# EAGLE design BPMLabRXDriver (EAGLE 7.5.0)
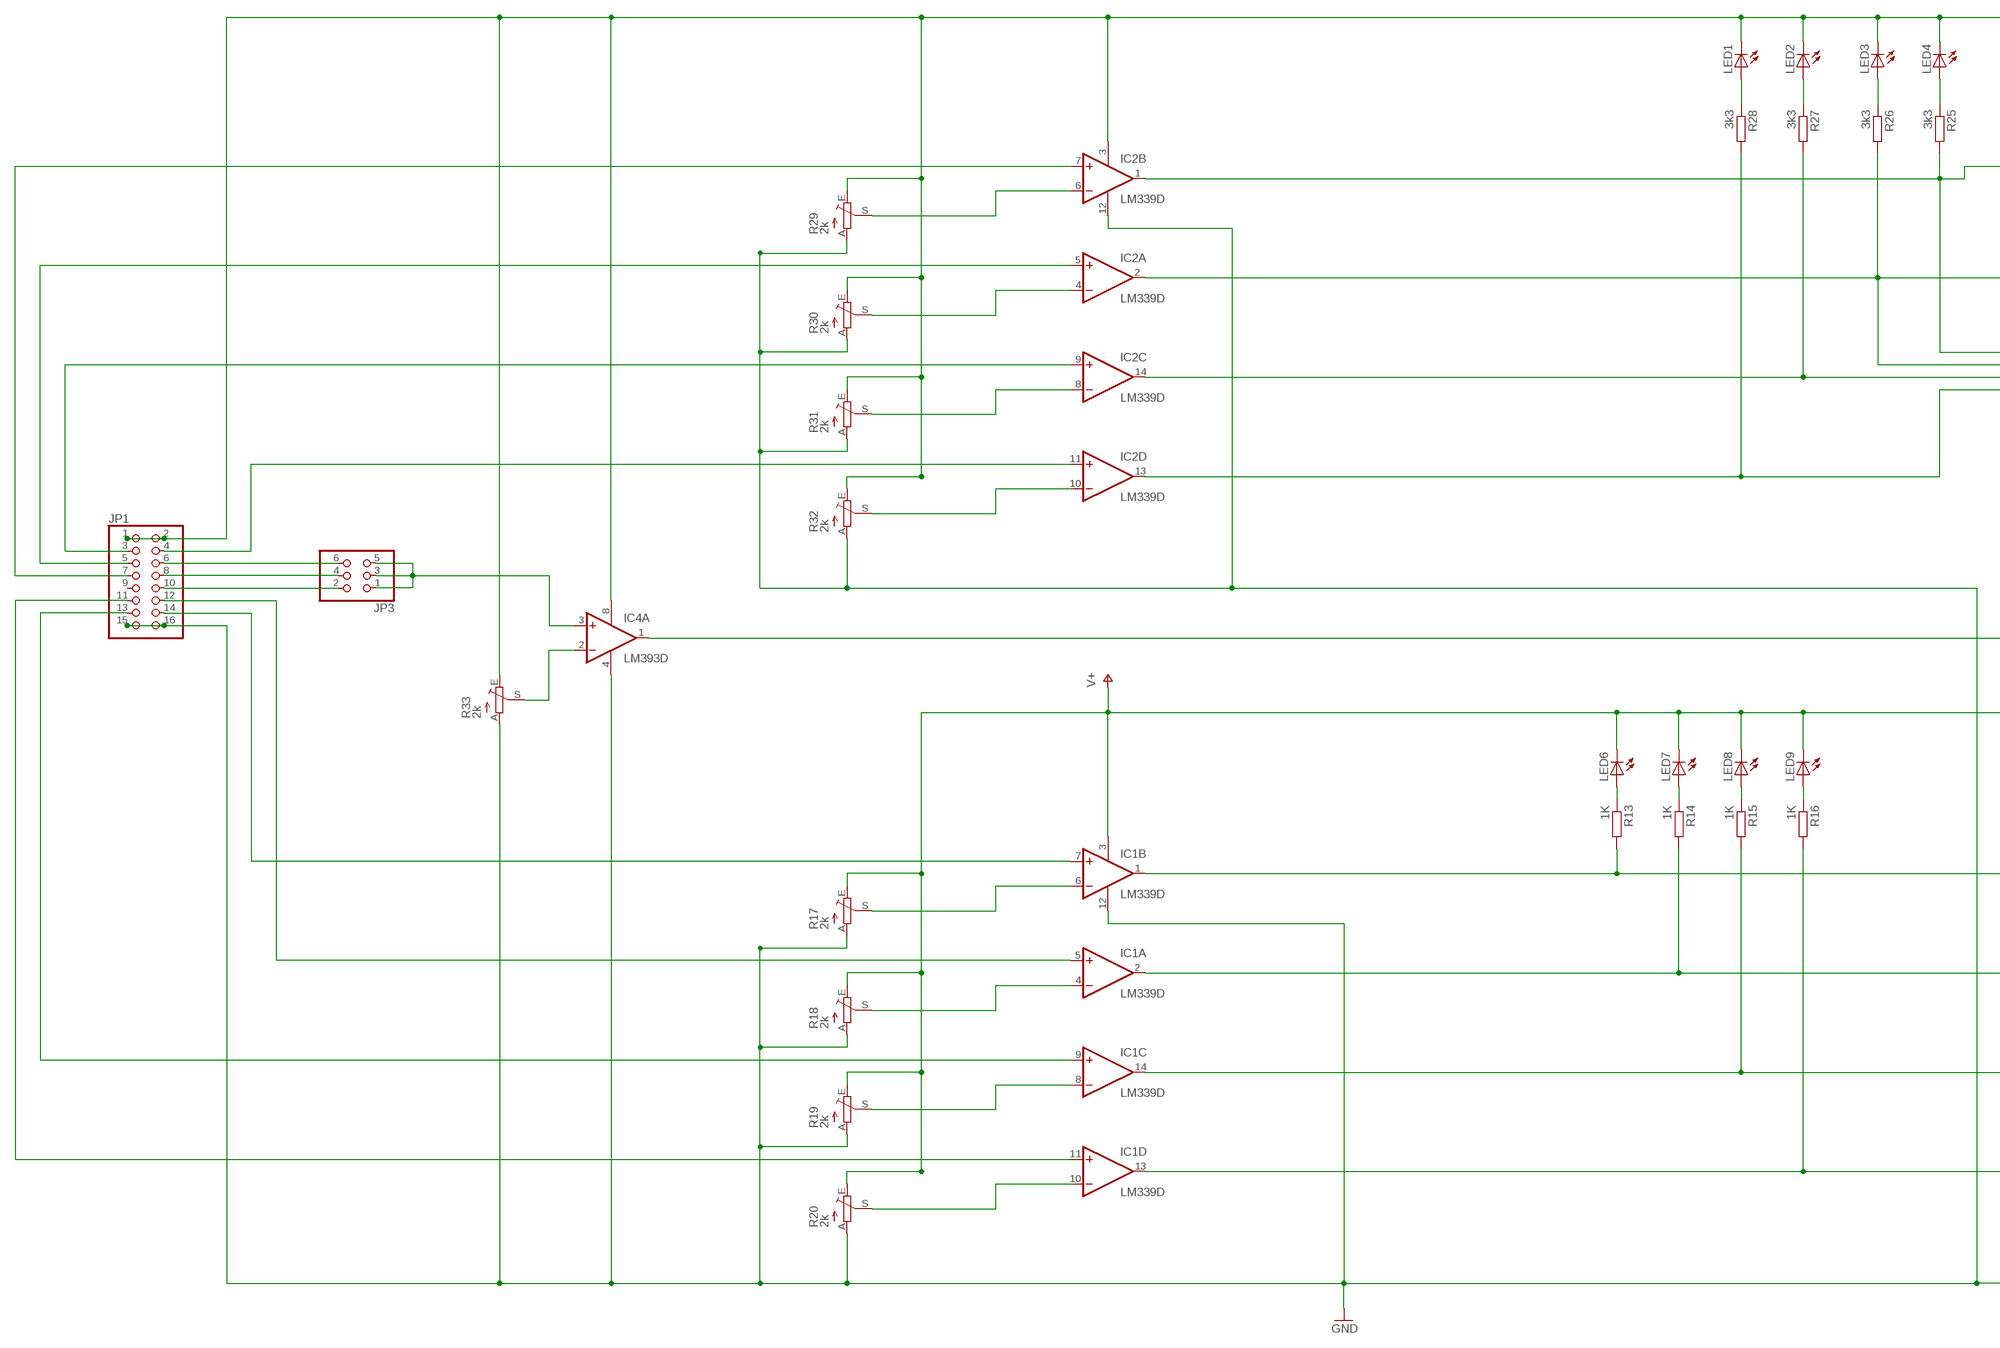
[diagram p0: schematic, sheet 1, part 1 of 2]
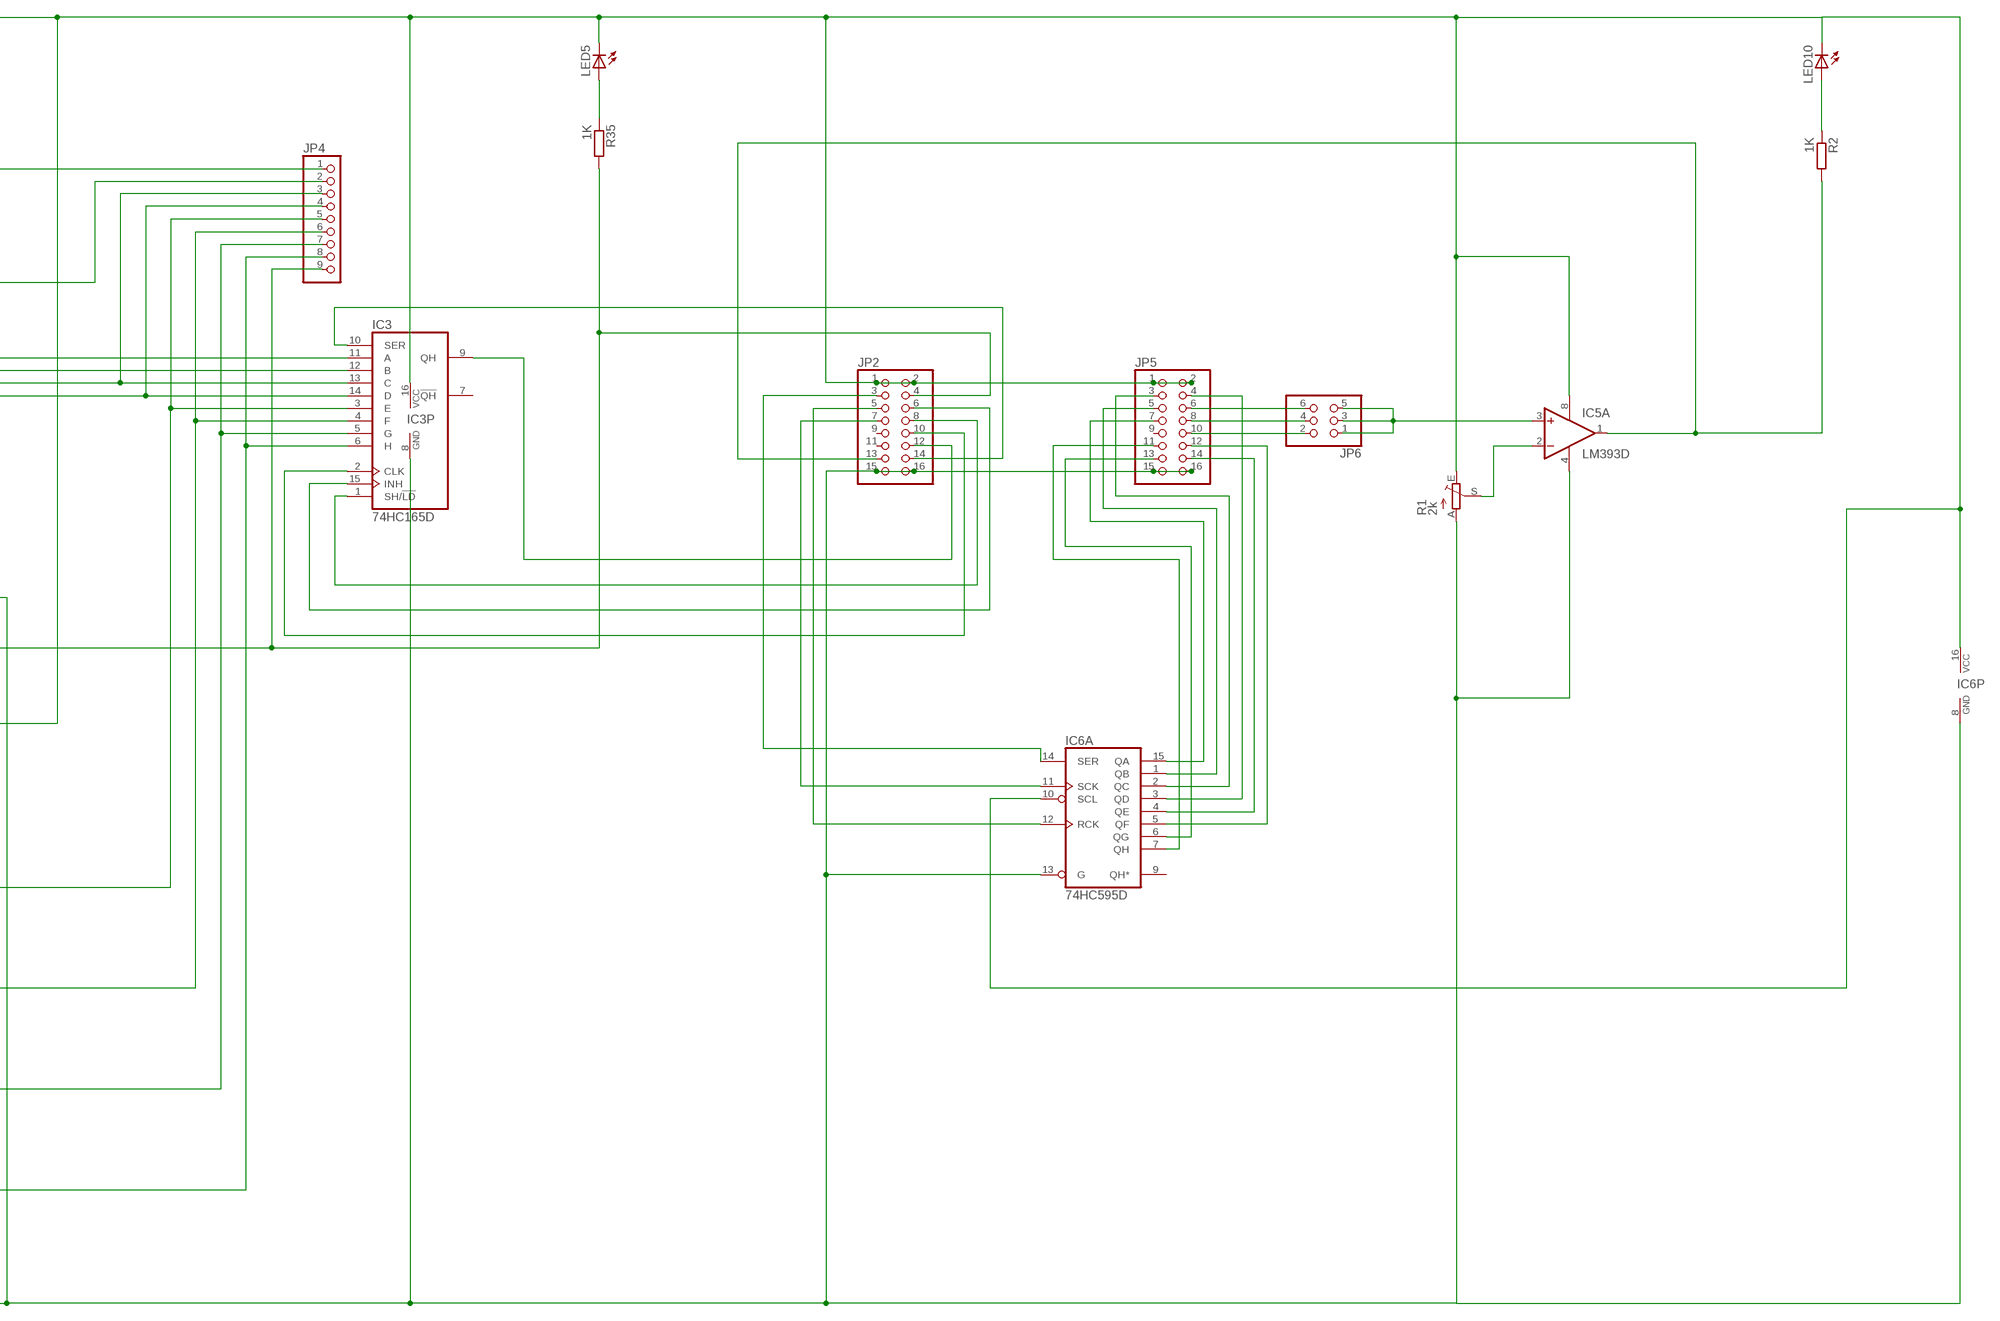
[diagram p1: schematic, sheet 1, part 2 of 2]

## Parts
IC1  LM339D  [SO14]
IC2  LM339D  [SO14]
IC3  74HC165D  [SO16]
IC4  LM393D  [SO08]
IC5  LM393D  [SO08]
IC6  74HC595D  [SO16]
JP1  PINHD-2X8  [2X08]
JP2  PINHD-2X8  [2X08]
JP3  PINHD-2X3  [2X03]
JP4  PINHD-1X9  [1X09]
JP5  PINHD-2X8  [2X08]
JP6  PINHD-2X3  [2X03]
LED1  LED5MM  [LED5MM]
LED2  LED5MM  [LED5MM]
LED3  LED5MM  [LED5MM]
LED4  LED5MM  [LED5MM]
LED5  LED5MM  [LED5MM]
LED6  LED5MM  [LED5MM]
LED7  LED5MM  [LED5MM]
LED8  LED5MM  [LED5MM]
LED9  LED5MM  [LED5MM]
LED10  LED5MM  [LED5MM]
R1  2k  TRIM_EU-RS3  [RS3]
R2  1K  R-EU_M0805  [M0805]
R13  1K  R-EU_M0805  [M0805]
R14  1K  R-EU_M0805  [M0805]
R15  1K  R-EU_M0805  [M0805]
R16  1K  R-EU_M0805  [M0805]
R17  2k  TRIM_EU-RS3  [RS3]
R18  2k  TRIM_EU-RS3  [RS3]
R19  2k  TRIM_EU-RS3  [RS3]
R20  2k  TRIM_EU-RS3  [RS3]
R25  3k3  R-EU_M0805  [M0805]
R26  3k3  R-EU_M0805  [M0805]
R27  3k3  R-EU_M0805  [M0805]
R28  3k3  R-EU_M0805  [M0805]
R29  2k  TRIM_EU-RS3  [RS3]
R30  2k  TRIM_EU-RS3  [RS3]
R31  2k  TRIM_EU-RS3  [RS3]
R32  2k  TRIM_EU-RS3  [RS3]
R33  2k  TRIM_EU-RS3  [RS3]
R35  1K  R-EU_M0805  [M0805]

## Nets
GND: IC1.12(P:GND) IC2.12(P:GND) IC3.8(GND) IC4.4(P:V-) IC5.4(P:V-) IC6.8(P:GND) IC6.13(A:G) JP1.15 JP1.16 JP2.15 JP2.16 JP5.15 JP5.16 R1.A R17.A R18.A R19.A R20.A R29.A R30.A R31.A R32.A R33.A
N$1: IC1.7(B:+IN) JP1.14
N$2: IC3.10(SER) JP2.14
N$3: IC1.9(C:+IN) JP1.13
N$4: IC2.7(B:+IN) JP1.7
N$5: IC1.13(D:OUT) IC3.6(H) JP4.8 R16.2
N$6: IC1.14(C:OUT) IC3.5(G) JP4.7 R15.2
N$7: IC1.2(A:OUT) IC3.4(F) JP4.6 R14.2
N$8: IC1.1(B:OUT) IC3.3(E) JP4.5 R13.2
N$9: LED6.A R13.1
N$10: LED7.A R14.1
N$11: LED8.A R15.1
N$12: LED9.A R16.1
N$13: IC1.6(B:-IN) R17.S
N$14: JP5.6 JP6.6
N$15: JP5.8 JP6.4
N$16: JP5.10 JP6.2
N$17: IC5.3(A:+IN) JP6.1 JP6.3 JP6.5
N$18: IC2.5(A:+IN) JP1.5
N$19: IC2.9(C:+IN) JP1.3
N$20: IC1.4(A:-IN) R18.S
N$21: IC1.8(C:-IN) R19.S
N$22: IC1.10(D:-IN) R20.S
N$23: IC2.13(D:OUT) IC3.14(D) JP4.4 R28.2
N$24: IC2.14(C:OUT) IC3.13(C) JP4.3 R27.2
N$25: IC1.11(D:+IN) JP1.11
N$26: IC2.2(A:OUT) IC3.12(B) JP4.2 R26.2
N$27: IC2.1(B:OUT) IC3.11(A) JP4.1 R25.2
N$28: LED1.A R28.1
N$29: LED2.A R27.1
N$30: LED3.A R26.1
N$31: LED4.A R25.1
N$32: LED5.A R35.1
N$33: IC6.15(A:QA) JP5.7
N$34: IC6.14(A:SER) JP2.3
N$35: IC5.2(A:-IN) R1.S
N$36: IC2.6(B:-IN) R29.S
N$37: IC2.4(A:-IN) R30.S
N$38: IC2.8(C:-IN) R31.S
N$39: IC2.10(D:-IN) R32.S
N$40: IC2.11(D:+IN) JP1.4
N$41: IC6.11(A:SCK) JP2.7
N$42: IC4.1(A:OUT) JP2.4 JP4.9 R35.2
N$43: IC3.15(INH) JP2.6
N$44: IC3.1(SH/!LD) JP2.8
N$45: IC3.2(CLK) JP2.10
N$46: IC3.9(QH) JP2.12
N$47: IC6.12(A:RCK) JP2.5
N$48: IC1.5(A:+IN) JP1.12
N$49: IC5.1(A:OUT) JP2.13 R2.2
N$50: JP1.6 JP3.6
N$51: JP1.8 JP3.4
N$52: JP1.10 JP3.2
N$53: IC4.3(A:+IN) JP3.1 JP3.3 JP3.5
N$54: IC4.2(A:-IN) R33.S
N$55: IC6.1(A:QB) JP5.5
N$56: LED10.A R2.1
N$57: IC6.2(A:QC) JP5.3
N$58: IC6.3(A:QD) JP5.4
N$59: IC6.4(A:QE) JP5.14
N$60: IC6.5(A:QF) JP5.12
N$61: IC6.6(A:QG) JP5.13
N$62: IC6.7(A:QH) JP5.11
VCC: IC1.3(P:V+) IC2.3(P:V+) IC3.16(VCC) IC4.8(P:V+) IC5.8(P:V+) IC6.10(A:SCL) IC6.16(P:VCC) JP1.1 JP1.2 JP2.1 JP2.2 JP5.1 JP5.2 LED1.K(C) LED2.K(C) LED3.K(C) LED4.K(C) LED5.K(C) LED6.K(C) LED7.K(C) LED8.K(C) LED9.K(C) LED10.K(C) R1.E R17.E R18.E R19.E R20.E R29.E R30.E R31.E R32.E R33.E ; supply symbol labelled V+
Unconnected: IC3.7(!QH) IC4.5(B:+IN) IC4.6(B:-IN) IC4.7(B:OUT) IC5.5(B:+IN) IC5.6(B:-IN) IC5.7(B:OUT) IC6.9(A:QH*) JP1.9 JP2.9 JP2.11 JP5.9

## Library data of the parts
IC1 IC2 = linear:LM339: Low Power Low Offset Voltage Quad Comparators with open collector; LM139/LM239/LM339/LM2901/LM3302
IC3 = 74xx-eu:74*165: 8-bit parallel load SHIFT REGISTER
IC4 IC5 = linear:LM393: COMPARATOR
IC6 = 74xx-eu:74*595: 8-bit SHIFT REGISTER, output latch
JP1 JP2 JP5 = pinhead:PINHD-2X8: PIN HEADER
JP3 JP6 = pinhead:PINHD-2X3: PIN HEADER
JP4 = pinhead:PINHD-1X9: PIN HEADER
LED1-LED10 = led:LED: LED OSRAM: - CHIPLED LG R971, LG N971, LY N971, LG Q971, LY Q971, LO R971, LY R971 LH N974, LH R974 LS Q976, LO Q976, LY Q976 LO Q996 - Hyper CHIPLED LW Q18S LB Q993, LB Q99A, LB R99A - SideLED LS A670, LO A670, LY A670, LG A670, LP A670 LB A673, LV A673, LT A673, LW A673 LH A674 LY A675 LS A676, LA A676, LO A676, LY A676, LW A676 LS A679, LY A679, LG A679 - Hyper Micro SIDELED® LS Y876, LA Y876, LO Y876, LY Y876 LT Y87S - SmartLED LW L88C, LW L88S LB L89C, LB L89S, LG L890 LS L89K, LO L89K, LY L89K LS L896, LA L896, LO L896, LY L896 - TOPLED LS T670, LO T670, LY T670, LG T670, LP T670 LSG T670, LSP T670, LSY T670, LOP T670, LYG T670 LG T671, LOG T671, LSG T671 LB T673, LV T673, LT T673, LW T673 LH T674 LS T676, LA T676, LO T676, LY T676, LB T676, LH T676, LSB T676, LW T676 LB T67C, LV T67C, LT T67C, LS T67K, LO T67K, LY T67K, LW E67C LS E67B, LA E67B, LO E67B, LY E67B, LB E67C, LV E67C, LT E67C LW T67C LS T679, LY T679, LG T679 LS T770, LO T770, LY T770, LG T770, LP T770 LB T773, LV T773, LT T773, LW T773 LH T774 LS E675, LA E675, LY E675, LS T675 LS T776, LA T776, LO T776, LY T776, LB T776 LHGB T686 LT T68C, LB T68C - Hyper Mini TOPLED® LB M676 - Mini TOPLED Santana® LG M470 LS M47K, LO M47K, LY M47K Source: http://www.osram.convergy.de LUXEON: - LUMILED® LXK2-PW12-R00, LXK2-PW12-S00, LXK2-PW14-U00, LXK2-PW14-V00 LXK2-PM12-R00, LXK2-PM12-S00, LXK2-PM14-U00 LXK2-PE12-Q00, LXK2-PE12-R00, LXK2-PE12-S00, LXK2-PE14-T00, LXK2-PE14-U00 LXK2-PB12-K00, LXK2-PB12-L00, LXK2-PB12-M00, LXK2-PB14-N00, LXK2-PB14-P00, LXK2-PB14-Q00 LXK2-PR12-L00, LXK2-PR12-M00, LXK2-PR14-Q00, LXK2-PR14-R00 LXK2-PD12-Q00, LXK2-PD12-R00, LXK2-PD12-S00 LXK2-PH12-R00, LXK2-PH12-S00 LXK2-PL12-P00, LXK2-PL12-Q00, LXK2-PL12-R00 Source: www.luxeon.com KINGBRIGHT: KA-3528ASYC Source: www.kingbright.com
R1 R17-R20 R29-R33 = pot:TRIM_EU-: POTENTIOMETER
R2 R13-R16 R25-R28 R35 = resistor:R-EU_: RESISTOR, European symbol

## Board
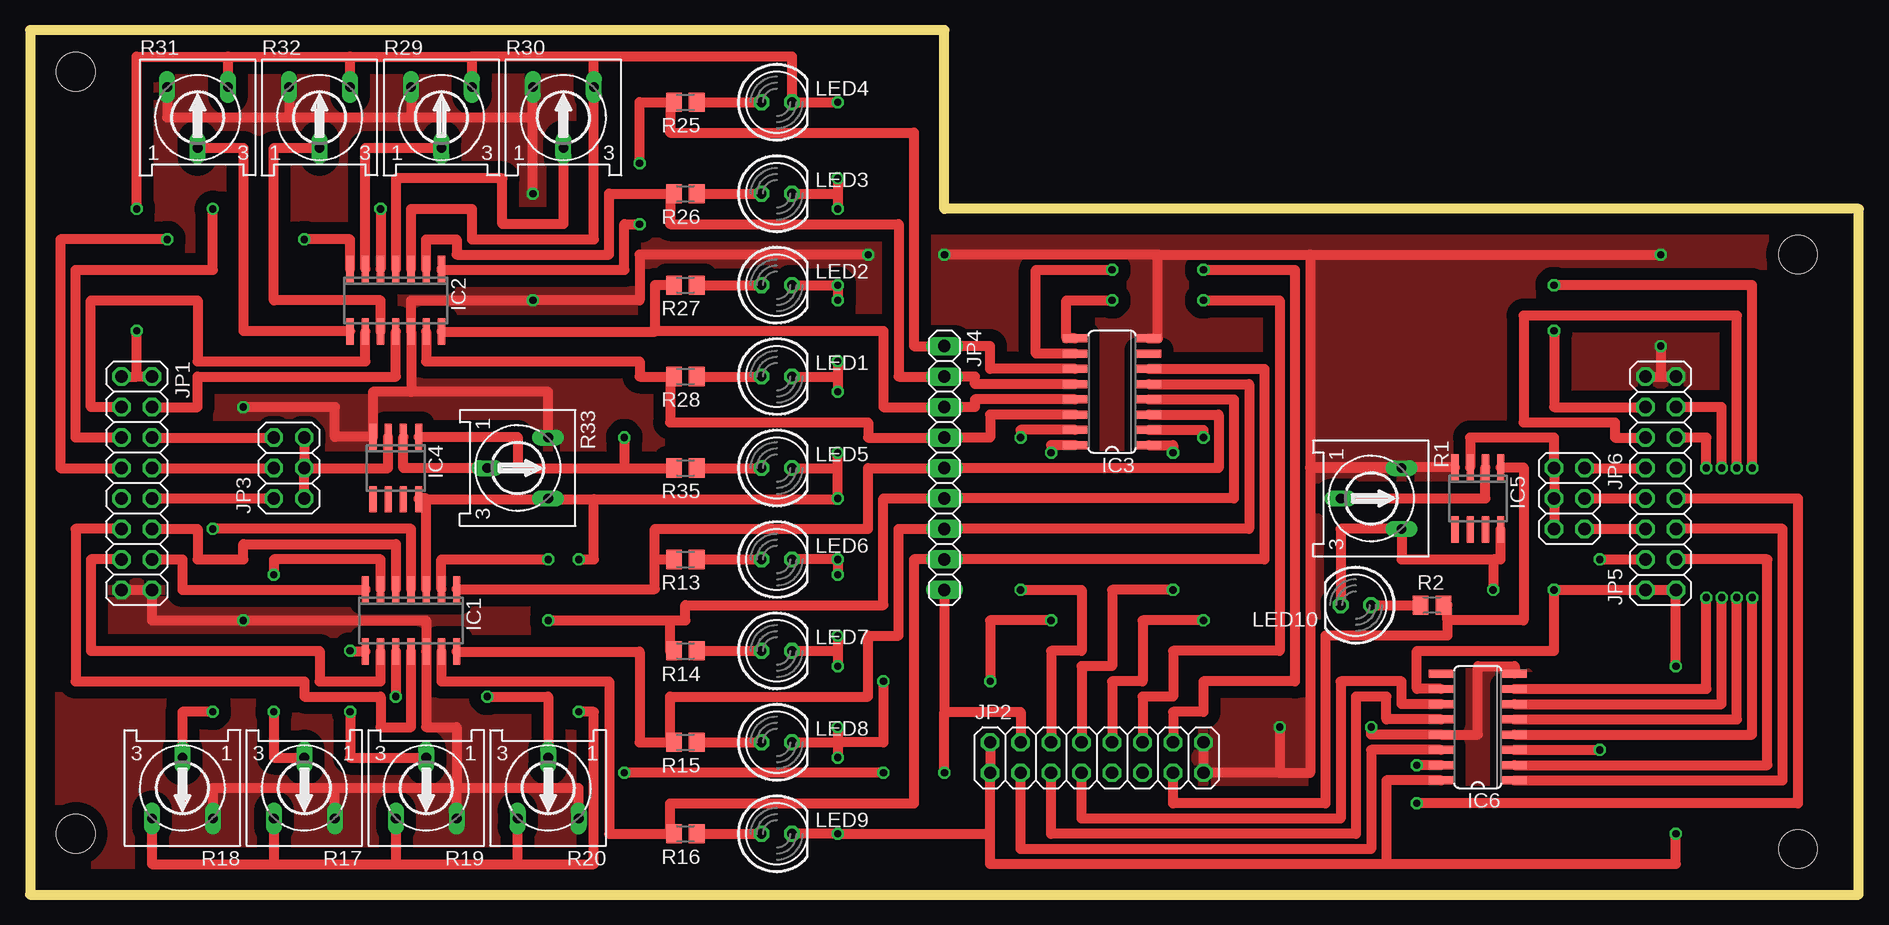
[diagram p2: board, top side]
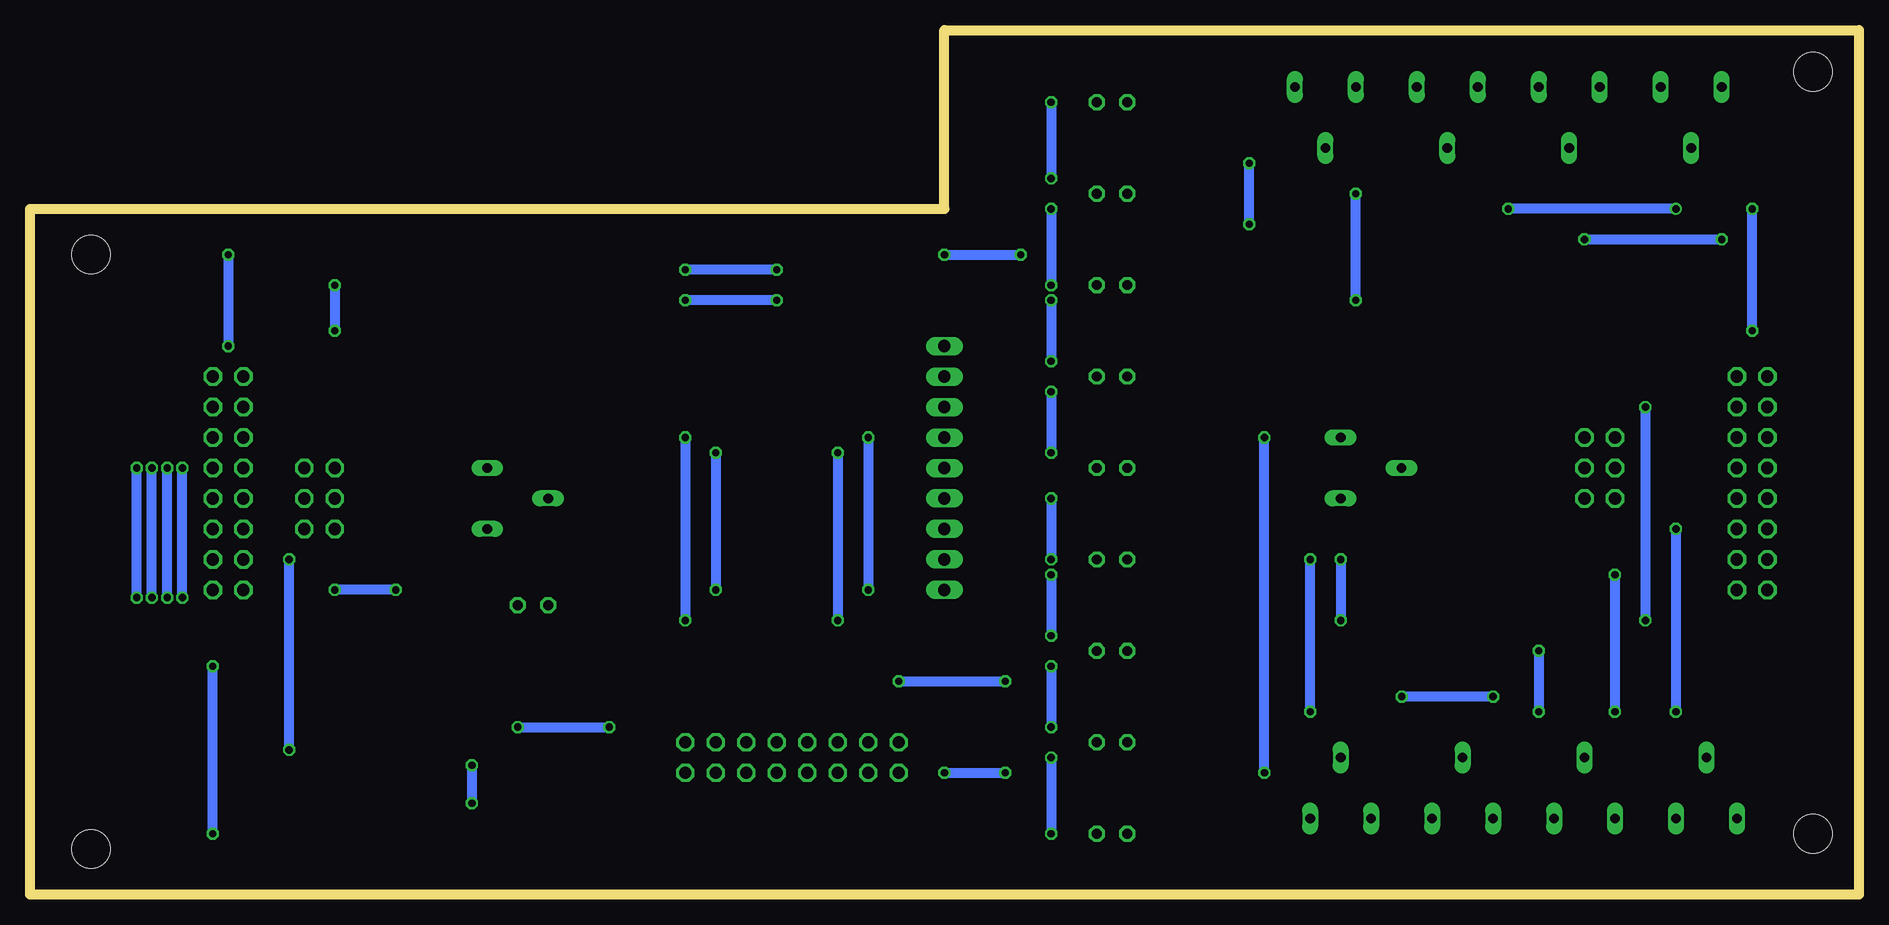
[diagram p3: board, bottom side, seen from below]

Size 152.4 x 72.06 mm. Coordinates in mm from the lower left corner, seen from the top.
Outline: 0,0 152.38,0 152.4,57.15 76.2,57.15 76.2,72.06 0,72.06 0,0
Copper layers (1*16): Top 0.035mm / dielectric 1.5mm / Bottom 0.035mm
Design rules "default *": minimum track width 10mil, minimum drill 20mil, track to track 8mil, track to pad 8mil, pad to pad 8mil, via to via 8mil, smd to smd 8mil, copper to edge 40mil, drill to drill 8mil, minimum pad ring 10mil, minimum via ring 8mil, stop-mask expansion 4mil, vias tented up to drill 0mil, thermal gap 0mil
Holes 3.2 mm at 3.81,68.58 3.81,5.08 147.32,3.81 147.32,53.34

### Footprints (pad centres in the part's own frame; a part is rotated, then mirrored left to right if it is on the bottom)
SO14 = smd 0.6 x 2.2: 1 -3.81,-2.6; 2 -2.54,-2.6; 3 -1.27,-2.6; 4 0,-2.6; 5 1.27,-2.6; 6 2.54,-2.6; 7 3.81,-2.6; 8 3.81,2.6; 9 2.54,2.6; 10 1.27,2.6; 11 0,2.6; 12 -1.27,2.6; 13 -2.54,2.6; 14 -3.81,2.6
SO16 = smd 0.66 x 2.032: 1 -4.445,-3.073; 2 -3.175,-3.073; 3 -1.905,-3.073; 4 -0.635,-3.073; 5 0.635,-3.073; 6 1.905,-3.073; 7 3.175,-3.073; 8 4.445,-3.073; 9 4.445,3.073; 10 3.175,3.073; 11 1.905,3.073; 12 0.635,3.073; 13 -0.635,3.073; 14 -1.905,3.073; 15 -3.175,3.073; 16 -4.445,3.073
SO08 = smd 0.6 x 2.2: 1 -1.905,-2.6; 2 -0.635,-2.6; 3 0.635,-2.6; 4 1.905,-2.6; 5 1.905,2.6; 6 0.635,2.6; 7 -0.635,2.6; 8 -1.905,2.6
2X08 = drill 1.016 octagon: 1 -8.89,-1.27; 2 -8.89,1.27; 3 -6.35,-1.27; 4 -6.35,1.27; 5 -3.81,-1.27; 6 -3.81,1.27; 7 -1.27,-1.27; 8 -1.27,1.27; 9 1.27,-1.27; 10 1.27,1.27; 11 3.81,-1.27; 12 3.81,1.27; 13 6.35,-1.27; 14 6.35,1.27; 15 8.89,-1.27; 16 8.89,1.27
2X03 = drill 1.016 octagon: 1 -2.54,-1.27; 2 -2.54,1.27; 3 0,-1.27; 4 0,1.27; 5 2.54,-1.27; 6 2.54,1.27
1X09 = drill 1.016 long: 1 -10.16,0; 2 -7.62,0; 3 -5.08,0; 4 -2.54,0; 5 0,0; 6 2.54,0; 7 5.08,0; 8 7.62,0; 9 10.16,0
LED5MM = drill 0.813 octagon: A -1.27,0; K 1.27,0
RS3 = drill 0.813 long: A -2.54,2.54; E 2.54,2.54; S 0,-2.54
M0805 = smd 1.3 x 1.6: 1 -0.95,0; 2 0.95,0

### Placement (x,y rotation side)
IC1  31.75,22.86 180 top
IC2  30.48,49.53 180 top
IC3  90.17,41.91 90 top
IC4  30.48,35.56 180 top
IC5  120.65,33.02 180 top
IC6  120.65,13.97 90 top
JP1  8.89,34.29 270 top
JP2  88.9,11.43 0 top
JP3  21.59,35.56 90 top
JP4  76.2,35.56 270 top
JP5  135.89,34.29 90 top
JP6  128.27,33.02 270 top
LED1  62.23,43.18 0 top
LED2  62.23,50.8 0 top
LED3  62.23,58.42 0 top
LED4  62.23,66.04 0 top
LED5  62.23,35.56 0 top
LED6  62.23,27.94 0 top
LED7  62.23,20.32 0 top
LED8  62.23,12.7 0 top
LED9  62.23,5.08 0 top
LED10  110.49,24.13 180 top
R1  111.76,33.02 270 top
R2  116.84,24.13 0 top
R13  54.61,27.94 180 top
R14  54.61,20.32 180 top
R15  54.61,12.7 180 top
R16  54.61,5.08 180 top
R17  22.86,8.89 180 top
R18  12.7,8.89 180 top
R19  33.02,8.89 180 top
R20  43.18,8.89 180 top
R25  54.61,66.04 180 top
R26  54.61,58.42 180 top
R27  54.61,50.8 180 top
R28  54.61,43.18 180 top
R29  34.29,64.77 0 top
R30  44.45,64.77 0 top
R31  13.97,64.77 0 top
R32  24.13,64.77 0 top
R33  40.64,35.56 270 top
R35  54.61,35.56 180 top

### Tracks (layer width: path | path; a pad name or v marks a point on that pad's centre or on a via)
GND  (via drill 0.6)
  Top 0.813: R31.A 11.43,64.77 21.59,64.77 | R32.A 21.59,64.77 | 21.59,64.77 31.75,64.77 | R29.A 31.75,64.77 | 31.75,64.77 41.91,64.77 | 41.91,64.77 R30.A | 31.75,41.91 IC2.12 31.75,49.53 v41.91,49.53 50.8,49.53 50.8,53.34 v69.85,53.34 | 31.75,41.91 28.57,41.91 IC4.4 25.4,38.16 25.4,40.64 v17.78,40.64 | R33.A 43.18,41.91 31.75,41.91 | JP1.15 JP1.16 10.16,22.86 v17.78,22.86 33.02,22.86 IC1.12 33.02,13.97 35.56,13.97 35.56,8.89 | R20.A 45.72,8.89 35.56,8.89 | R19.A 35.56,8.89 | 35.56,8.89 25.4,8.89 | R17.A 25.4,8.89 | 25.4,8.89 15.24,8.89 R18.A | v41.91,58.42 41.91,64.77 | JP2.16 JP2.15 104.14,10.16 | 93.98,53.34 106.68,53.34 | 106.68,53.34 106.68,35.62 | 106.68,35.62 106.68,35.56 | 106.68,35.56 106.68,10.16 104.14,10.16 | 93.98,53.34 v76.2,53.34 | IC3.8 93.98,46.35 93.98,53.34 | 106.68,53.34 v135.89,53.34 | JP5.16 135.89,43.18 | v135.89,45.72 135.89,43.18 | 135.89,43.18 JP5.15 | IC5.4 106.68,35.62 | IC6.8 123.72,19.05 120.65,19.05 120.65,13.34 IC6.13 111.76,13.34 v111.76,13.97 | v104.14,13.97 104.14,10.16 | R1.A 106.68,35.56
  Bottom 0.813: v17.78,40.64 v17.78,22.86 | v41.91,49.53 v41.91,58.42 | v76.2,53.34 v69.85,53.34 | v135.89,53.34 v135.89,45.72 | v111.76,13.97 v104.14,13.97
  pour Top (isolate 1.016): 2.54,69.85 73.66,69.85 73.66,54.61 149.86,54.61 149.86,2.54 2.54,2.54
N$1
  Top 0.813: JP1.14 12.7,27.94 12.7,25.4 27.94,25.4 IC1.7
N$2  (via drill 0.6)
  Top 0.813: IC3.10 83.82,45.09 83.82,52.07 v90.17,52.07 | v97.79,52.07 105.41,52.07 105.41,17.78 97.79,17.78 97.79,15.24 95.25,15.24 JP2.14
  Bottom 0.813: v90.17,52.07 v97.79,52.07
N$3
  Top 0.813: JP1.13 5.08,27.94 5.08,20.32 24.13,20.32 24.13,17.78 29.21,17.78 IC1.9
N$4  (via drill 0.6)
  Top 0.813: IC2.7 26.67,54.61 v22.86,54.61 | v11.43,54.61 2.54,54.61 2.54,35.56 JP1.7
  Bottom 0.813: v22.86,54.61 v11.43,54.61
N$5
  Top 0.813: IC1.13 34.29,17.78 48.26,17.78 48.26,5.08 R16.2 53.34,5.08 53.34,7.62 73.66,7.62 73.66,27.94 JP4.8 102.87,27.94 102.87,43.81 IC3.6
N$6
  Top 0.813: IC1.14 50.8,20.26 50.8,12.7 R15.2 53.34,12.7 53.34,16.51 69.85,16.51 69.85,21.59 72.39,21.59 72.39,30.48 JP4.7 101.6,30.48 101.6,42.55 IC3.5
N$7  (via drill 0.6)
  Top 0.813: IC1.2 34.29,27.94 v43.18,27.94 | v43.18,22.86 53.34,22.86 | R14.2 53.34,20.32 53.34,22.86 | 53.34,22.86 54.61,22.86 54.61,24.13 71.12,24.13 71.12,33.02 JP4.6 100.33,33.02 100.33,41.27 IC3.4
  Bottom 0.813: v43.18,27.94 v43.18,22.86
N$8
  Top 0.813: IC1.1 52.07,25.46 52.07,27.94 | 52.07,27.94 R13.2 | 52.07,27.94 52.07,30.48 69.85,30.48 69.85,35.56 JP4.5 99.06,35.56 99.06,40.01 IC3.3
N$9
  Top 0.813: R13.1 LED6.A
N$10
  Top 0.813: R14.1 LED7.A
N$11
  Top 0.813: R15.1 LED8.A
N$12
  Top 0.813: R16.1 LED9.A
N$13  (via drill 0.6)
  Top 0.813: IC1.6 29.21,27.94 20.32,27.94 v20.32,26.67 | v20.32,15.24 20.32,11.43 R17.S
  Bottom 0.813: v20.32,26.67 v20.32,15.24
N$14
  Top 0.813: JP6.6 JP5.6
N$15
  Top 0.813: JP6.4 JP5.8
N$16
  Top 0.813: JP6.2 JP5.10
N$17
  Top 0.813: IC5.3 120.02,38.1 127,38.1 JP6.1 JP6.3 JP6.5
N$18  (via drill 0.6)
  Top 0.813: JP1.5 3.81,38.1 3.81,52.07 15.24,52.07 v15.24,57.15 | v29.21,57.15 IC2.5
  Bottom 0.813: v15.24,57.15 v29.21,57.15
N$19
  Top 0.813: JP1.3 5.08,40.64 5.08,49.53 13.97,49.53 13.97,44.45 27.94,44.45 IC2.9
N$20  (via drill 0.6)
  Top 0.813: IC1.4 31.75,30.48 v15.24,30.48 | v15.24,15.24 12.7,15.24 R18.S
  Bottom 0.813: v15.24,30.48 v15.24,15.24
N$21  (via drill 0.6)
  Top 0.813: IC1.8 26.67,20.26 v26.67,20.32 | v26.67,15.24 26.67,11.43 R19.S
  Bottom 0.813: v26.67,20.32 v26.67,15.24
N$22  (via drill 0.6)
  Top 0.813: IC1.10 v30.48,16.51 | v38.1,16.51 43.18,16.51 R20.S
  Bottom 0.813: v30.48,16.51 v38.1,16.51
N$23
  Top 0.813: IC2.13 33.02,44.45 50.8,44.45 50.8,43.18 R28.2 53.34,43.18 53.34,39.37 69.85,39.37 69.85,38.1 JP4.4 80.01,38.1 80.01,40.01 IC3.14
N$24
  Top 0.813: IC2.14 52.07,46.93 52.07,46.99 | R27.2 52.07,50.8 52.07,46.99 | 52.07,46.99 71.12,46.99 71.12,40.64 JP4.3 78.74,40.64 78.74,41.27 IC3.13
N$25
  Top 0.813: JP1.11 3.81,30.48 3.81,17.78 22.86,17.78 22.86,16.51 29.21,16.51 29.21,13.97 31.75,13.97 IC1.11
N$26
  Top 0.813: IC2.2 33.02,54.61 35.56,54.61 35.56,53.34 48.26,53.34 48.26,58.42 53.34,58.42 | R26.2 53.34,58.42 | 53.34,58.42 53.34,55.88 72.39,55.88 72.39,43.18 JP4.2 78.74,43.18 78.74,42.55 IC3.12
N$27  (via drill 0.6)
  Top 0.813: IC2.1 34.29,52.07 49.53,52.07 49.53,55.88 v50.8,55.88 | v50.8,60.96 50.8,66.04 R25.2 53.34,66.04 53.34,63.5 73.66,63.5 73.66,45.72 JP4.1 80.01,45.72 80.01,43.81 IC3.11
  Bottom 0.813: v50.8,55.88 v50.8,60.96
N$28
  Top 0.813: R28.1 LED1.A
N$29
  Top 0.813: R27.1 LED2.A
N$30
  Top 0.813: R26.1 LED3.A
N$31
  Top 0.813: R25.1 LED4.A
N$32
  Top 0.813: R35.1 LED5.A
N$33  (via drill 0.6)
  Top 0.813: JP5.7 147.32,33.02 147.32,7.62 v115.57,7.62 | IC6.15 v115.57,10.79
  Bottom 0.813: v115.57,10.79 v115.57,7.62
N$34
  Top 0.813: IC6.14 111.76,12.06 111.76,3.81 82.55,3.81 JP2.3
N$35
  Top 0.813: R1.S 121.28,33.02 IC5.2
N$36
  Top 0.813: IC2.6 27.94,62.23 R29.S
N$37
  Top 0.813: R30.S 44.45,55.88 39.37,55.88 39.37,59.69 30.48,59.69 IC2.4
N$38
  Top 0.813: R31.S 17.78,62.23 17.78,46.99 26.67,46.99 IC2.8
N$39
  Top 0.813: IC2.10 29.21,49.53 20.32,49.53 20.32,62.23 R32.S
N$40
  Top 0.813: JP1.4 13.97,40.64 13.97,43.18 30.48,43.18 IC2.11
N$41
  Top 0.813: IC6.11 114.3,15.88 114.3,17.78 109.22,17.78 109.22,6.35 87.63,6.35 JP2.7
N$42  (via drill 0.6)
  Top 0.813: IC4.1 40.64,38.16 40.64,35.56 49.53,35.56 | 49.53,35.56 R35.2 | v71.12,10.16 v49.53,10.16 | v49.53,38.1 49.53,35.56 | JP4.9 76.2,15.24 | v76.2,10.16 76.2,15.24 | 76.2,15.24 82.55,15.24 JP2.4
  Bottom 0.813: v76.2,10.16 v71.12,10.16 | v49.53,10.16 v49.53,38.1
N$43  (via drill 0.6)
  Top 0.813: IC3.15 82.55,38.73 v82.55,38.1 | v82.55,25.4 87.63,25.4 87.63,20.32 85.09,20.32 JP2.6
  Bottom 0.813: v82.55,38.1 v82.55,25.4
N$44  (via drill 0.6)
  Top 0.813: IC3.1 95.25,37.47 v95.25,36.83 | v95.25,25.4 90.17,25.4 90.17,19.05 87.63,19.05 JP2.8
  Bottom 0.813: v95.25,36.83 v95.25,25.4
N$45  (via drill 0.6)
  Top 0.813: IC3.2 97.79,38.73 v97.79,38.1 | v97.79,22.86 92.71,22.86 92.71,17.78 90.17,17.78 JP2.10
  Bottom 0.813: v97.79,38.1 v97.79,22.86
N$46  (via drill 0.6)
  Top 0.813: IC3.9 86.36,46.35 86.36,49.53 v90.17,49.53 | v97.79,49.53 104.14,49.53 104.14,20.32 95.25,20.32 95.25,16.51 92.71,16.51 JP2.12
  Bottom 0.813: v90.17,49.53 v97.79,49.53
N$47
  Top 0.813: IC6.12 113.03,14.61 113.03,16.51 110.49,16.51 110.49,5.08 85.09,5.08 JP2.5
N$48
  Top 0.813: JP1.12 13.97,30.48 13.97,27.94 17.78,27.94 17.78,29.21 30.48,29.21 IC1.5
N$49
  Top 0.813: IC5.1 124.46,35.62 124.46,22.86 118.11,22.86 | 118.11,22.86 118.11,24.13 R2.2 | 118.11,22.86 118.11,21.59 107.95,21.59 107.95,7.62 95.25,7.62 JP2.13
N$50
  Top 0.813: JP1.6 JP3.6
N$51
  Top 0.813: JP1.8 JP3.4
N$52
  Top 0.813: JP1.10 JP3.2
N$53
  Top 0.813: JP3.1 JP3.3 | JP3.5 JP3.3 | JP3.3 29.84,35.56 IC4.3
N$54
  Top 0.813: R33.S 31.11,35.56 IC4.2
N$55
  Top 0.813: IC6.1 146.05,9.53 146.05,30.48 JP5.5
N$56
  Top 0.813: LED10.A R2.1
N$57
  Top 0.813: IC6.2 144.78,10.79 144.78,27.94 JP5.3
N$58  (via drill 0.6)
  Top 0.813: IC6.3 v130.81,12.06 | v130.81,27.94 JP5.4
  Bottom 0.813: v130.81,12.06 v130.81,27.94
N$59  (via drill 0.6)
  Top 0.813: IC6.4 143.51,13.34 v143.51,24.77 | v143.51,35.56 143.51,50.8 v127,50.8 | v127,46.99 127,40.64 JP5.14
  Bottom 0.813: v143.51,24.77 v143.51,35.56 | v127,50.8 v127,46.99
N$60  (via drill 0.6)
  Top 0.813: IC6.5 142.24,14.61 v142.24,24.77 | v142.24,35.56 142.24,48.26 124.46,48.26 124.46,39.37 132.08,39.37 132.08,38.1 JP5.12
  Bottom 0.813: v142.24,24.77 v142.24,35.56
N$61  (via drill 0.6)
  Top 0.813: IC6.6 140.97,15.88 v140.97,24.77 | v140.97,35.56 140.97,40.64 JP5.13
  Bottom 0.813: v140.97,24.77 v140.97,35.56
N$62  (via drill 0.6)
  Top 0.813: IC6.7 139.7,17.14 v139.7,24.77 | v139.7,35.56 139.7,38.1 JP5.11
  Bottom 0.813: v139.7,24.77 v139.7,35.56
VCC  (via drill 0.6)
  Top 0.813: JP1.2 8.89,43.18 | JP1.1 8.89,43.18 | 8.89,43.18 v8.89,46.99 | v8.89,57.15 8.89,69.85 16.51,69.85 | R31.E 16.51,69.85 | 16.51,69.85 26.67,69.85 | R32.E 26.67,69.85 | 26.67,69.85 36.83,69.85 | 36.83,69.85 R29.E | 46.99,69.85 R30.E 46.99,54.61 36.83,54.61 36.83,57.15 31.75,57.15 IC2.3 | 46.99,69.85 36.83,69.85 | 46.99,69.85 63.5,69.85 LED4.K v67.31,66.04 | 67.31,35.56 v67.31,33.02 67.31,32.96 46.99,32.96 | 67.31,35.56 v67.31,36.83 | v67.31,59.69 67.31,58.42 | LED3.K 67.31,58.42 | 67.31,58.42 v67.31,57.15 | LED2.K v67.31,50.8 v67.31,49.53 | v67.31,44.45 67.31,43.18 | LED1.K 67.31,43.18 | 67.31,43.18 v67.31,41.91 | LED6.K v67.31,27.94 v67.31,26.67 | IC1.3 33.02,33.02 32.38,33.02 IC4.8 | IC4.8 43.18,32.96 R33.E | IC4.8 46.99,32.96 | v67.31,21.59 67.31,20.32 | LED7.K 67.31,20.32 | 67.31,20.32 v67.31,19.05 | v67.31,13.97 67.31,12.7 | LED8.K 67.31,12.7 | 67.31,12.7 v67.31,11.43 | LED9.K v67.31,5.08 80.01,5.08 JP2.1 | JP2.2 JP2.1 | LED5.K 67.31,35.56 | IC3.16 85.09,37.47 v85.09,36.83 | v85.09,22.86 80.01,22.86 v80.01,17.78 | v71.12,17.78 71.12,12.7 67.31,12.7 | 113.03,2.54 137.16,2.54 v137.16,5.08 | 113.03,2.54 80.01,2.54 JP2.1 | LED10.K 109.22,30.48 R1.E 114.3,27.94 121.92,27.94 | IC5.8 122.56,27.94 121.92,27.94 | R18.E 10.16,2.54 20.32,2.54 | R17.E 20.32,2.54 | 20.32,2.54 30.48,2.54 | 30.48,2.54 40.64,2.54 | 40.64,2.54 R20.E | R19.E 30.48,2.54 | 40.64,2.54 46.99,2.54 46.99,15.24 v45.72,15.24 | v45.72,27.94 46.99,27.94 46.99,32.96 | 121.92,27.94 v121.92,25.4 | IC6.10 115.57,17.14 115.57,20.32 127,20.32 v127,25.4 JP5.2 JP5.1 v137.16,19.05 | IC6.16 113.03,9.53 113.03,2.54
  Bottom 0.813: v8.89,46.99 v8.89,57.15 | v67.31,66.04 v67.31,59.69 | v67.31,57.15 v67.31,50.8 | v67.31,49.53 v67.31,44.45 | v67.31,41.91 v67.31,36.83 | v67.31,33.02 v67.31,27.94 | v67.31,26.67 v67.31,21.59 | v67.31,19.05 v67.31,13.97 | v67.31,11.43 v67.31,5.08 | v85.09,36.83 v85.09,22.86 | v80.01,17.78 v71.12,17.78 | v45.72,15.24 v45.72,27.94 | v121.92,25.4 v127,25.4 | v137.16,5.08 v137.16,19.05